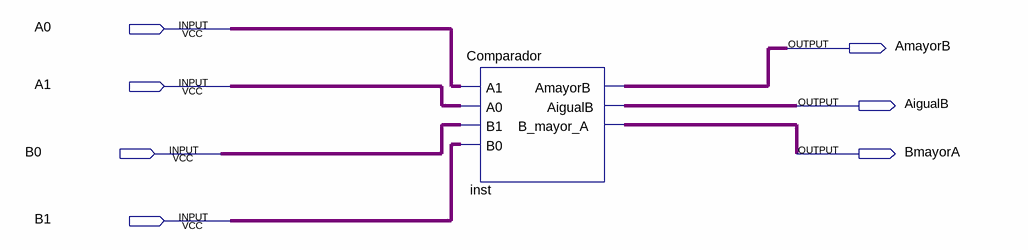
[diagram p0: schematic sheet]
// Quartus schematic Practica2J.bdf as structural Verilog: 1 symbols, 7 pins
module Practica2J (
  input  A0,
  input  A1,
  input  B0,
  input  B1,
  output AmayorB,
  output AigualB,
  output BmayorA
);

  Comparador inst (.A1(A0), .A0(A1), .B1(B0), .B0(B1), .AmayorB(AmayorB), .AigualB(AigualB), .B_mayor_A(BmayorA));
endmodule
